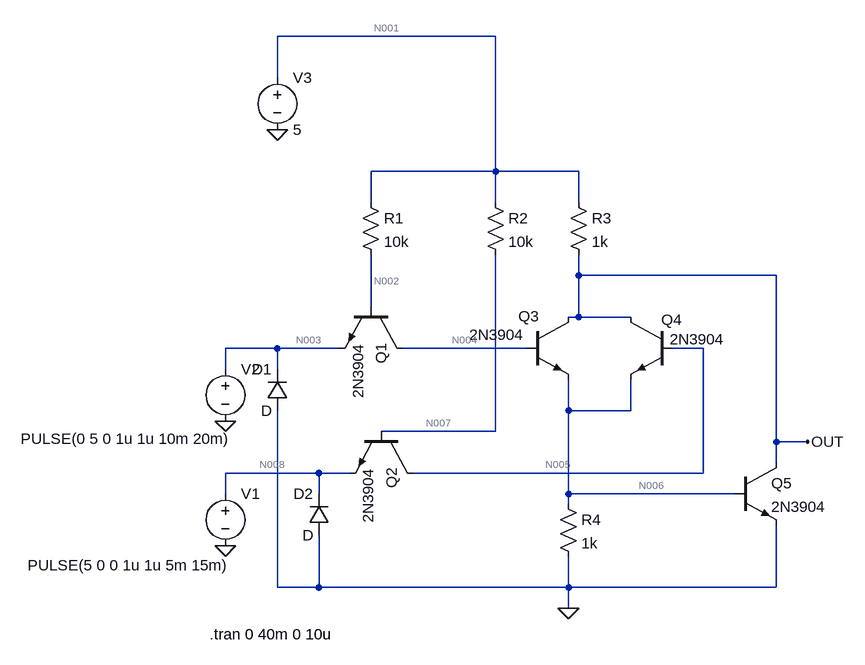
[diagram p0: schematic Draft2.asc]
Draft2.asc, the LTspice schematic file:
Version 4.1
SHEET 1 980 680
WIRE 432 -528 96 -528
WIRE 96 -464 96 -528
WIRE 432 -320 432 -528
WIRE 432 -320 240 -320
WIRE 560 -320 432 -320
WIRE 240 -272 240 -320
WIRE 432 -272 432 -320
WIRE 560 -272 560 -320
WIRE 560 -160 560 -192
WIRE 864 -160 560 -160
WIRE 240 -112 240 -192
WIRE 560 -96 560 -160
WIRE 560 -96 544 -96
WIRE 640 -96 560 -96
WIRE 96 -48 16 -48
WIRE 192 -48 96 -48
WIRE 480 -48 288 -48
WIRE 752 -48 704 -48
WIRE 16 -16 16 -48
WIRE 96 -16 96 -48
WIRE 544 48 544 0
WIRE 640 48 640 0
WIRE 640 48 544 48
WIRE 432 80 432 -192
WIRE 432 80 256 80
WIRE 864 96 864 -160
WIRE 912 96 864 96
WIRE 864 128 864 96
WIRE 160 144 16 144
WIRE 208 144 160 144
WIRE 752 144 752 -48
WIRE 752 144 304 144
WIRE 16 176 16 144
WIRE 160 176 160 144
WIRE 544 176 544 48
WIRE 800 176 544 176
WIRE 544 192 544 176
WIRE 96 320 96 48
WIRE 160 320 160 240
WIRE 160 320 96 320
WIRE 544 320 544 272
WIRE 544 320 160 320
WIRE 864 320 864 224
WIRE 864 320 544 320
WIRE 544 352 544 320
FLAG 16 64 0
FLAG 16 256 0
FLAG 544 352 0
FLAG 912 96 OUT
FLAG 96 -384 0
SYMBOL voltage 16 160 R0
WINDOW 3 -304 126 Left 2
SYMATTR InstName V1
SYMATTR Value PULSE(5 0 0 1u 1u 5m 15m)
SYMBOL voltage 16 -32 R0
WINDOW 3 -315 123 Left 2
SYMATTR InstName V2
SYMATTR Value PULSE(0 5 0 1u 1u 10m 20m)
SYMBOL npn 288 -112 R90
SYMATTR InstName Q1
SYMATTR Value 2N3904
SYMBOL npn 304 80 R90
SYMATTR InstName Q2
SYMATTR Value 2N3904
SYMBOL res 224 -288 R0
SYMATTR InstName R1
SYMATTR Value 10k
SYMBOL res 416 -288 R0
SYMATTR InstName R2
SYMATTR Value 10k
SYMBOL res 544 -288 R0
SYMATTR InstName R3
SYMATTR Value 1k
SYMBOL npn 480 -96 R0
WINDOW 0 -13 -1 Left 2
WINDOW 3 -88 27 Left 2
SYMATTR InstName Q3
SYMATTR Value 2N3904
SYMBOL npn 704 -96 M0
WINDOW 0 -15 4 Left 2
WINDOW 3 -81 34 Left 2
SYMATTR InstName Q4
SYMATTR Value 2N3904
SYMBOL res 528 176 R0
SYMATTR InstName R4
SYMATTR Value 1k
SYMBOL npn 800 128 R0
SYMATTR InstName Q5
SYMATTR Value 2N3904
SYMBOL voltage 96 -480 R0
WINDOW 123 0 0 Left 0
WINDOW 39 0 0 Left 0
SYMATTR InstName V3
SYMATTR Value 5
SYMBOL diode 112 48 R180
WINDOW 0 24 64 Left 2
WINDOW 3 24 0 Left 2
SYMATTR InstName D1
SYMBOL diode 176 240 R180
WINDOW 0 24 64 Left 2
WINDOW 3 24 0 Left 2
SYMATTR InstName D2
TEXT -8 392 Left 2 !.tran 0 40m 0 10u

The netlist it stands for:
* Draft2.asc
V1 N008 0 PULSE(5 0 0 1u 1u 5m 15m)
V2 N003 0 PULSE(0 5 0 1u 1u 10m 20m)
Q1 N004 N002 N003 0 2N3904
Q2 N005 N007 N008 0 2N3904
R1 N001 N002 10k
R2 N001 N007 10k
R3 N001 OUT 1k
Q3 OUT N004 N006 0 2N3904
Q4 OUT N005 N006 0 2N3904
R4 N006 0 1k
Q5 OUT N006 0 0 2N3904
V3 N001 0 5
D1 0 N003 D
D2 0 N008 D
.model D D
.lib standard.dio
.model NPN NPN
.model PNP PNP
.lib standard.bjt
.tran 0 40m 0 10u
.backanno
.end

* Results of the author's LTspice run, read from the files saved beside the schematic
* Operating Point, zero values left out:
*   V(n002) = 683.3 mV
*   V(n005) = 1.43 V
*   V(n001) = 5 V
*   V(n008) = 5 V
*   V(n004) = 5.877 mV
*   V(n007) = 2.095 V
*   V(out) = 701.1 mV
*   V(n006) = 698.1 mV
*   I(V1) = -1.154 mA
*   Ic(Q1) = 1.39 pA
*   Ib(Q1) = 431.7 µA
*   Ie(Q1) = -431.7 µA
*   I(R2) = 290.5 µA
*   Ic(Q5) = 5.029 mA
*   Ib(Q5) = 16.97 µA
*   Ie(Q5) = -5.046 mA
*   I(R1) = 431.7 µA
*   Ib(Q3) = -1.39 pA
*   I(D2) = -5.01 pA
*   Ic(Q2) = -1.445 mA
*   Ib(Q2) = 290.5 µA
*   Ie(Q2) = 1.154 mA
*   I(R3) = 4.299 mA
*   I(R4) = 698.1 µA
*   I(V2) = 431.7 µA
*   Ic(Q4) = -729.7 µA
*   Ib(Q4) = 1.445 mA
*   Ie(Q4) = -715 µA
*   I(V3) = -5.021 mA
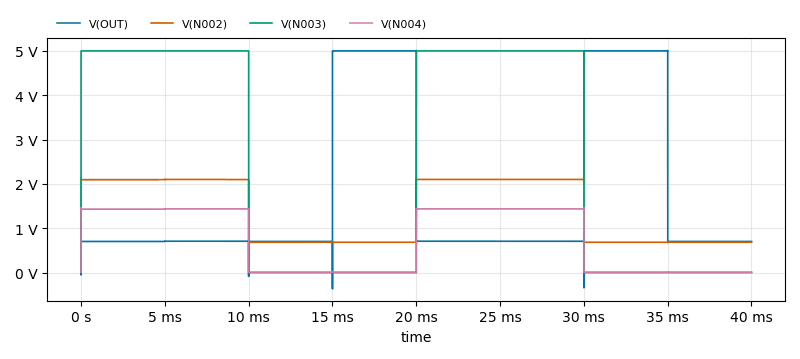
[diagram p1: Transient Analysis of Draft2.asc, plotted from the saved traces]
* Transient Analysis, 1 run:
*   V(OUT): min -367.2 mV, max 5.012 V, average 1.778 V, rms 2.573 V, last 701.1 mV
*   V(N002): min 675.8 mV, max 2.14 V, average 1.391 V, rms 1.561 V, last 683.3 mV
*   V(N003): min 0 V, max 5 V, average 2.5 V, rms 3.536 V, last 0 V
*   V(N004): min -1.434 mV, max 1.468 V, average 720.1 mV, rms 1.014 V, last 5.878 mV